# Altium schematic sheet Part21_UART_ZigBee.SchDoc
size A4
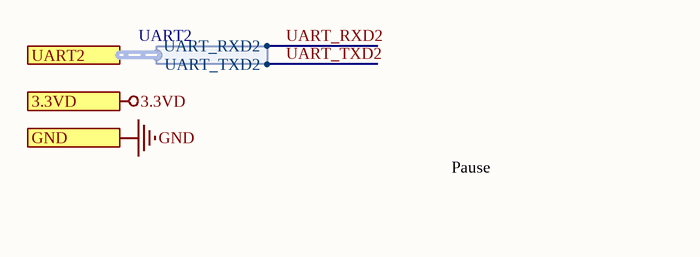
[diagram p0: Part21_UART_ZigBee.SchDoc]

## Ports
3.3VD, GND, UART2 (harness UART2)

## Harnesses
UART2: UART_RXD2, UART_TXD2

## Nets
3.3VD: port 3.3VD
GND: port GND
UART_RXD2: port UART2.UART_RXD2
UART_TXD2: port UART2.UART_TXD2

## Notes on the sheet
- Pause